# Altium schematic sheet TOP.SchDoc
size A4; SheetNumber: 1; SheetTotal: 4
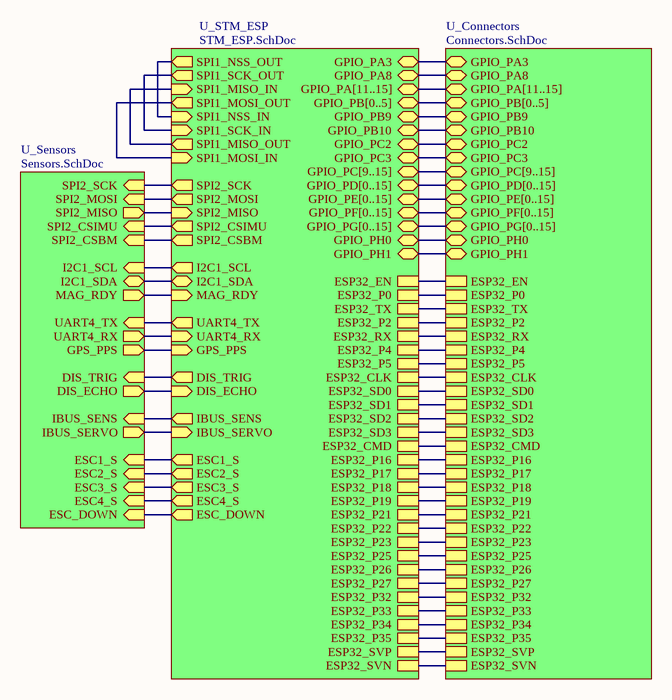
[diagram p0: TOP.SchDoc]

## Sub-sheets
U_Connectors = Connectors.SchDoc: GPIO_PA3 (bidir), GPIO_PA8 (bidir), GPIO_PB10 (bidir), GPIO_PC2 (bidir), GPIO_PC3 (bidir), GPIO_PH0 (bidir), GPIO_PH1 (bidir), ESP32_EN, ESP32_SVP, ESP32_SVN, ESP32_P34, ESP32_P35, ESP32_P32, ESP32_P33, ESP32_P25, ESP32_P26, ESP32_P27, ESP32_SD2, ESP32_SD3, ESP32_CMD, ESP32_P23, ESP32_P22, ESP32_TX, ESP32_RX, ESP32_P21, ESP32_P19, ESP32_P18, ESP32_P5, ESP32_P17, ESP32_P16, ESP32_P4, ESP32_P0, ESP32_SD1, ESP32_SD0, ESP32_CLK, ESP32_P2, GPIO_PB[0..5] (bidir), GPIO_PA[11..15] (bidir), GPIO_PB9 (bidir), GPIO_PC[9..15] (bidir), GPIO_PE[0..15] (bidir), GPIO_PD[0..15] (bidir), GPIO_PF[0..15] (bidir), GPIO_PG[0..15] (bidir)
U_Sensors = Sensors.SchDoc: IBUS_SENS (in), IBUS_SERVO (out), ESC1_S (in), ESC2_S (in), ESC3_S (in), ESC4_S (in), UART4_TX (in), UART4_RX (out), GPS_PPS (out), SPI2_CSIMU (in), SPI2_SCK (in), SPI2_MISO (out), SPI2_MOSI (in), SPI2_CSBM (in), I2C1_SCL (in), I2C1_SDA (bidir), MAG_RDY (out), DIS_TRIG (in), DIS_ECHO (out), ESC_DOWN (in)
U_STM_ESP = STM_ESP.SchDoc: UART4_TX (out), UART4_RX (in), I2C1_SCL (out), I2C1_SDA (bidir), SPI1_NSS_OUT (out), SPI1_SCK_OUT (out), SPI1_MISO_IN (in), SPI1_MOSI_OUT (out), SPI2_SCK (out), SPI2_MISO (in), SPI2_MOSI (out), GPS_PPS (in), SPI2_CSIMU (out), SPI2_CSBM (out), MAG_RDY (in), DIS_TRIG (out), DIS_ECHO (in), IBUS_SENS (out), IBUS_SERVO (in), ESC1_S (out), ESC2_S (out), ESC3_S (out), ESC4_S (out), ESC_DOWN (out), GPIO_PA3 (bidir), GPIO_PA8 (bidir), GPIO_PB9 (bidir), GPIO_PB10 (bidir), GPIO_PC2 (bidir), GPIO_PC3 (bidir), GPIO_PH0 (bidir), GPIO_PH1 (bidir), SPI1_SCK_IN (in), SPI1_MISO_OUT (out), SPI1_MOSI_IN (in), SPI1_NSS_IN (in), ESP32_EN, ESP32_SVP, ESP32_SVN, ESP32_P34, ESP32_P35, ESP32_P32, ESP32_P33, ESP32_P25, ESP32_P26, ESP32_P27, ESP32_SD2, ESP32_SD3, ESP32_CMD, ESP32_P23, ESP32_P22, ESP32_TX, ESP32_RX, ESP32_P21, ESP32_P19, ESP32_P18, ESP32_P5, ESP32_P17, ESP32_P16, ESP32_P4, ESP32_P0, ESP32_SD1, ESP32_SD0, ESP32_CLK, ESP32_P2, GPIO_PD[0..15] (bidir), GPIO_PG[0..15] (bidir), GPIO_PC[9..15] (bidir), GPIO_PA[11..15] (bidir), GPIO_PB[0..5] (bidir), GPIO_PF[0..15] (bidir), GPIO_PE[0..15] (bidir)

## Nets
(unnamed): sheet U_STM_ESP/UART4_TX, sheet U_Sensors/UART4_TX
(unnamed): sheet U_STM_ESP/UART4_RX, sheet U_Sensors/UART4_RX
(unnamed): sheet U_STM_ESP/I2C1_SCL, sheet U_Sensors/I2C1_SCL
(unnamed): sheet U_STM_ESP/I2C1_SDA, sheet U_Sensors/I2C1_SDA
(unnamed): sheet U_STM_ESP/SPI1_NSS_OUT, sheet U_STM_ESP/SPI1_NSS_IN
(unnamed): sheet U_STM_ESP/SPI1_SCK_OUT, sheet U_STM_ESP/SPI1_SCK_IN
(unnamed): sheet U_STM_ESP/SPI1_MISO_IN, sheet U_STM_ESP/SPI1_MISO_OUT
(unnamed): sheet U_STM_ESP/SPI1_MOSI_OUT, sheet U_STM_ESP/SPI1_MOSI_IN
(unnamed): sheet U_STM_ESP/SPI2_SCK, sheet U_Sensors/SPI2_SCK
(unnamed): sheet U_STM_ESP/SPI2_MISO, sheet U_Sensors/SPI2_MISO
(unnamed): sheet U_STM_ESP/SPI2_MOSI, sheet U_Sensors/SPI2_MOSI
(unnamed): sheet U_STM_ESP/GPS_PPS, sheet U_Sensors/GPS_PPS
(unnamed): sheet U_STM_ESP/SPI2_CSIMU, sheet U_Sensors/SPI2_CSIMU
(unnamed): sheet U_STM_ESP/SPI2_CSBM, sheet U_Sensors/SPI2_CSBM
(unnamed): sheet U_STM_ESP/MAG_RDY, sheet U_Sensors/MAG_RDY
(unnamed): sheet U_STM_ESP/DIS_TRIG, sheet U_Sensors/DIS_TRIG
(unnamed): sheet U_STM_ESP/DIS_ECHO, sheet U_Sensors/DIS_ECHO
(unnamed): sheet U_STM_ESP/IBUS_SENS, sheet U_Sensors/IBUS_SENS
(unnamed): sheet U_STM_ESP/IBUS_SERVO, sheet U_Sensors/IBUS_SERVO
(unnamed): sheet U_STM_ESP/ESC1_S, sheet U_Sensors/ESC1_S
(unnamed): sheet U_STM_ESP/ESC2_S, sheet U_Sensors/ESC2_S
(unnamed): sheet U_STM_ESP/ESC3_S, sheet U_Sensors/ESC3_S
(unnamed): sheet U_STM_ESP/ESC4_S, sheet U_Sensors/ESC4_S
(unnamed): sheet U_STM_ESP/ESC_DOWN, sheet U_Sensors/ESC_DOWN
(unnamed): sheet U_STM_ESP/GPIO_PA3, sheet U_Connectors/GPIO_PA3
(unnamed): sheet U_STM_ESP/GPIO_PA8, sheet U_Connectors/GPIO_PA8
(unnamed): sheet U_STM_ESP/GPIO_PB9, sheet U_Connectors/GPIO_PB9
(unnamed): sheet U_STM_ESP/GPIO_PB10, sheet U_Connectors/GPIO_PB10
(unnamed): sheet U_STM_ESP/GPIO_PC2, sheet U_Connectors/GPIO_PC2
(unnamed): sheet U_STM_ESP/GPIO_PC3, sheet U_Connectors/GPIO_PC3
(unnamed): sheet U_STM_ESP/GPIO_PH0, sheet U_Connectors/GPIO_PH0
(unnamed): sheet U_STM_ESP/GPIO_PH1, sheet U_Connectors/GPIO_PH1
(unnamed): sheet U_STM_ESP/ESP32_EN, sheet U_Connectors/ESP32_EN
(unnamed): sheet U_STM_ESP/ESP32_SVP, sheet U_Connectors/ESP32_SVP
(unnamed): sheet U_STM_ESP/ESP32_SVN, sheet U_Connectors/ESP32_SVN
(unnamed): sheet U_STM_ESP/ESP32_P34, sheet U_Connectors/ESP32_P34
(unnamed): sheet U_STM_ESP/ESP32_P35, sheet U_Connectors/ESP32_P35
(unnamed): sheet U_STM_ESP/ESP32_P32, sheet U_Connectors/ESP32_P32
(unnamed): sheet U_STM_ESP/ESP32_P33, sheet U_Connectors/ESP32_P33
(unnamed): sheet U_STM_ESP/ESP32_P25, sheet U_Connectors/ESP32_P25
(unnamed): sheet U_STM_ESP/ESP32_P26, sheet U_Connectors/ESP32_P26
(unnamed): sheet U_STM_ESP/ESP32_P27, sheet U_Connectors/ESP32_P27
(unnamed): sheet U_STM_ESP/ESP32_SD2, sheet U_Connectors/ESP32_SD2
(unnamed): sheet U_STM_ESP/ESP32_SD3, sheet U_Connectors/ESP32_SD3
(unnamed): sheet U_STM_ESP/ESP32_CMD, sheet U_Connectors/ESP32_CMD
(unnamed): sheet U_STM_ESP/ESP32_P23, sheet U_Connectors/ESP32_P23
(unnamed): sheet U_STM_ESP/ESP32_P22, sheet U_Connectors/ESP32_P22
(unnamed): sheet U_STM_ESP/ESP32_TX, sheet U_Connectors/ESP32_TX
(unnamed): sheet U_STM_ESP/ESP32_RX, sheet U_Connectors/ESP32_RX
(unnamed): sheet U_STM_ESP/ESP32_P21, sheet U_Connectors/ESP32_P21
(unnamed): sheet U_STM_ESP/ESP32_P19, sheet U_Connectors/ESP32_P19
(unnamed): sheet U_STM_ESP/ESP32_P18, sheet U_Connectors/ESP32_P18
(unnamed): sheet U_STM_ESP/ESP32_P5, sheet U_Connectors/ESP32_P5
(unnamed): sheet U_STM_ESP/ESP32_P17, sheet U_Connectors/ESP32_P17
(unnamed): sheet U_STM_ESP/ESP32_P16, sheet U_Connectors/ESP32_P16
(unnamed): sheet U_STM_ESP/ESP32_P4, sheet U_Connectors/ESP32_P4
(unnamed): sheet U_STM_ESP/ESP32_P0, sheet U_Connectors/ESP32_P0
(unnamed): sheet U_STM_ESP/ESP32_SD1, sheet U_Connectors/ESP32_SD1
(unnamed): sheet U_STM_ESP/ESP32_SD0, sheet U_Connectors/ESP32_SD0
(unnamed): sheet U_STM_ESP/ESP32_CLK, sheet U_Connectors/ESP32_CLK
(unnamed): sheet U_STM_ESP/ESP32_P2, sheet U_Connectors/ESP32_P2

## Buses and harness runs
bus sheet U_Connectors/GPIO_PA[11..15] = sheet U_STM_ESP/GPIO_PA[11..15]
bus sheet U_Connectors/GPIO_PB[0..5] = sheet U_STM_ESP/GPIO_PB[0..5]
bus sheet U_Connectors/GPIO_PC[9..15] = sheet U_STM_ESP/GPIO_PC[9..15]
bus sheet U_Connectors/GPIO_PD[0..15] = sheet U_STM_ESP/GPIO_PD[0..15]
bus sheet U_Connectors/GPIO_PE[0..15] = sheet U_STM_ESP/GPIO_PE[0..15]
bus sheet U_Connectors/GPIO_PF[0..15] = sheet U_STM_ESP/GPIO_PF[0..15]
bus sheet U_Connectors/GPIO_PG[0..15] = sheet U_STM_ESP/GPIO_PG[0..15]